# EAGLE design controller (EAGLE 7.3.0)
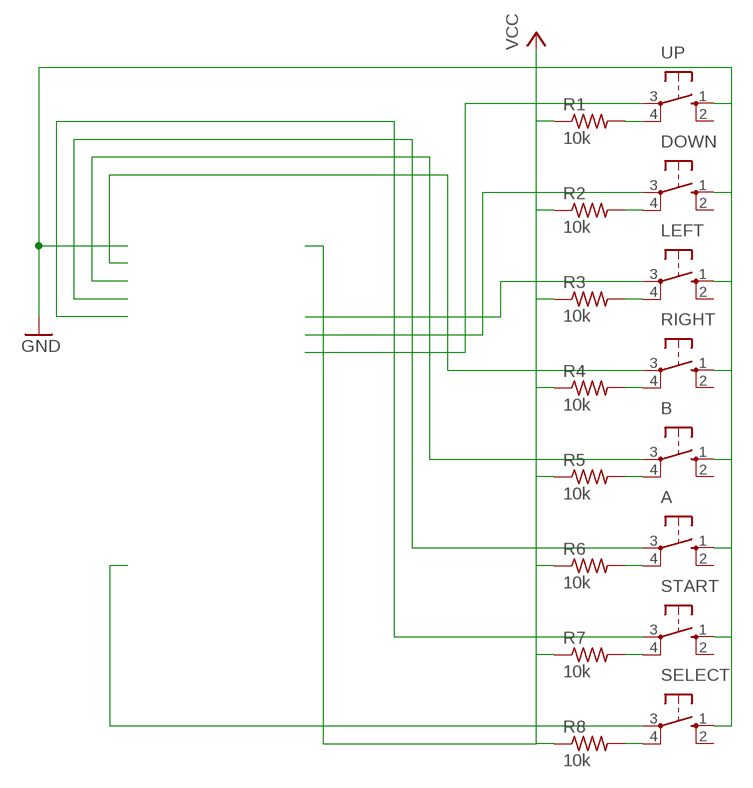
[diagram p0: schematic, sheet 1]

## Parts
A  10-XX  [B3F-10XX]
B  10-XX  [B3F-10XX]
DOWN  10-XX  [B3F-10XX]
LEFT  10-XX  [B3F-10XX]
R1  10k  R-US_0204/7  [0204/7]
R2  10k  R-US_0204/7  [0204/7]
R3  10k  R-US_0204/7  [0204/7]
R4  10k  R-US_0204/7  [0204/7]
R5  10k  R-US_0204/7  [0204/7]
R6  10k  R-US_0204/7  [0204/7]
R7  10k  R-US_0204/7  [0204/7]
R8  10k  R-US_0204/7  [0204/7]
RIGHT  10-XX  [B3F-10XX]
SELECT  10-XX  [B3F-10XX]
START  10-XX  [B3F-10XX]
UP  10-XX  [B3F-10XX]

## Nets
GND: A.1(S) B.1(S) DOWN.1(S) LEFT.1(S) RIGHT.1(S) SELECT.1(S) START.1(S) UP.1(S)
N$1: UP.3(P)
N$2: DOWN.3(P)
N$3: LEFT.3(P)
N$4: RIGHT.3(P)
N$5: B.3(P)
N$6: A.3(P)
N$7: START.3(P)
N$8: SELECT.3(P)
N$9: DOWN.4(P1) R2.2
N$10: LEFT.4(P1) R3.2
N$12: R1.1 R2.1 R3.1 R4.1 R5.1 R6.1 R7.1 R8.1 ; supply symbol labelled VCC
N$15: R7.2 START.4(P1)
N$16: R4.2 RIGHT.4(P1)
N$17: A.4(P1) R6.2
N$18: B.4(P1) R5.2
N$21: R8.2 SELECT.4(P1)
N$35: R1.2 UP.4(P1)
Unconnected: A.2(S1) B.2(S1) DOWN.2(S1) LEFT.2(S1) RIGHT.2(S1) SELECT.2(S1) START.2(S1) UP.2(S1)

## Library data of the parts
A B DOWN LEFT RIGHT SELECT START UP = switch-omron:10-XX: OMRON SWITCH; MPN: B3F-1000; OC_FARNELL: 176432; OC_NEWARK: 36M3542
R1-R8 = adafruit:R-US_: RESISTOR, American symbol

## Board
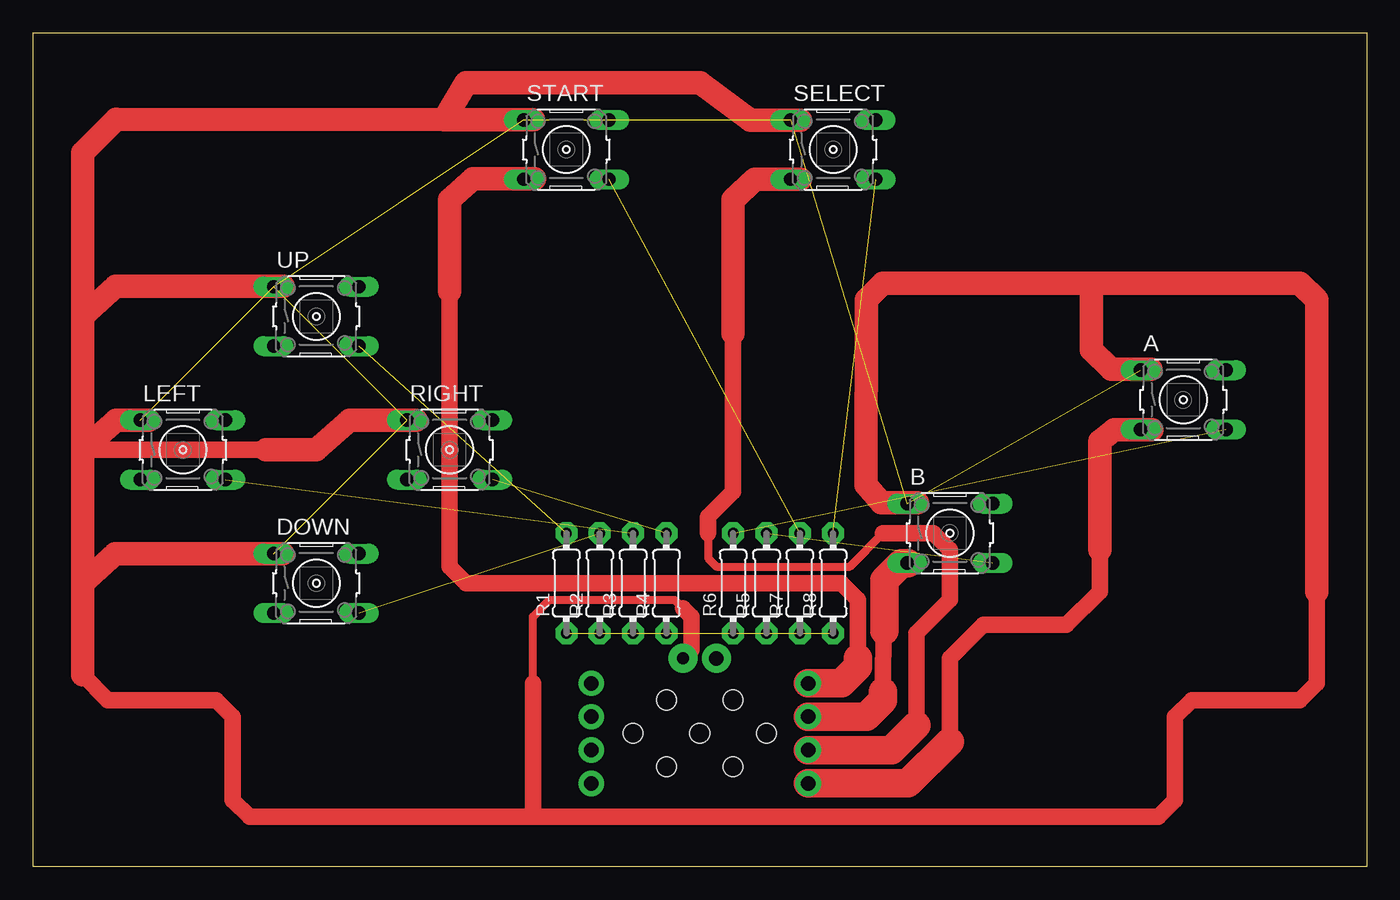
[diagram p1: board, top side]
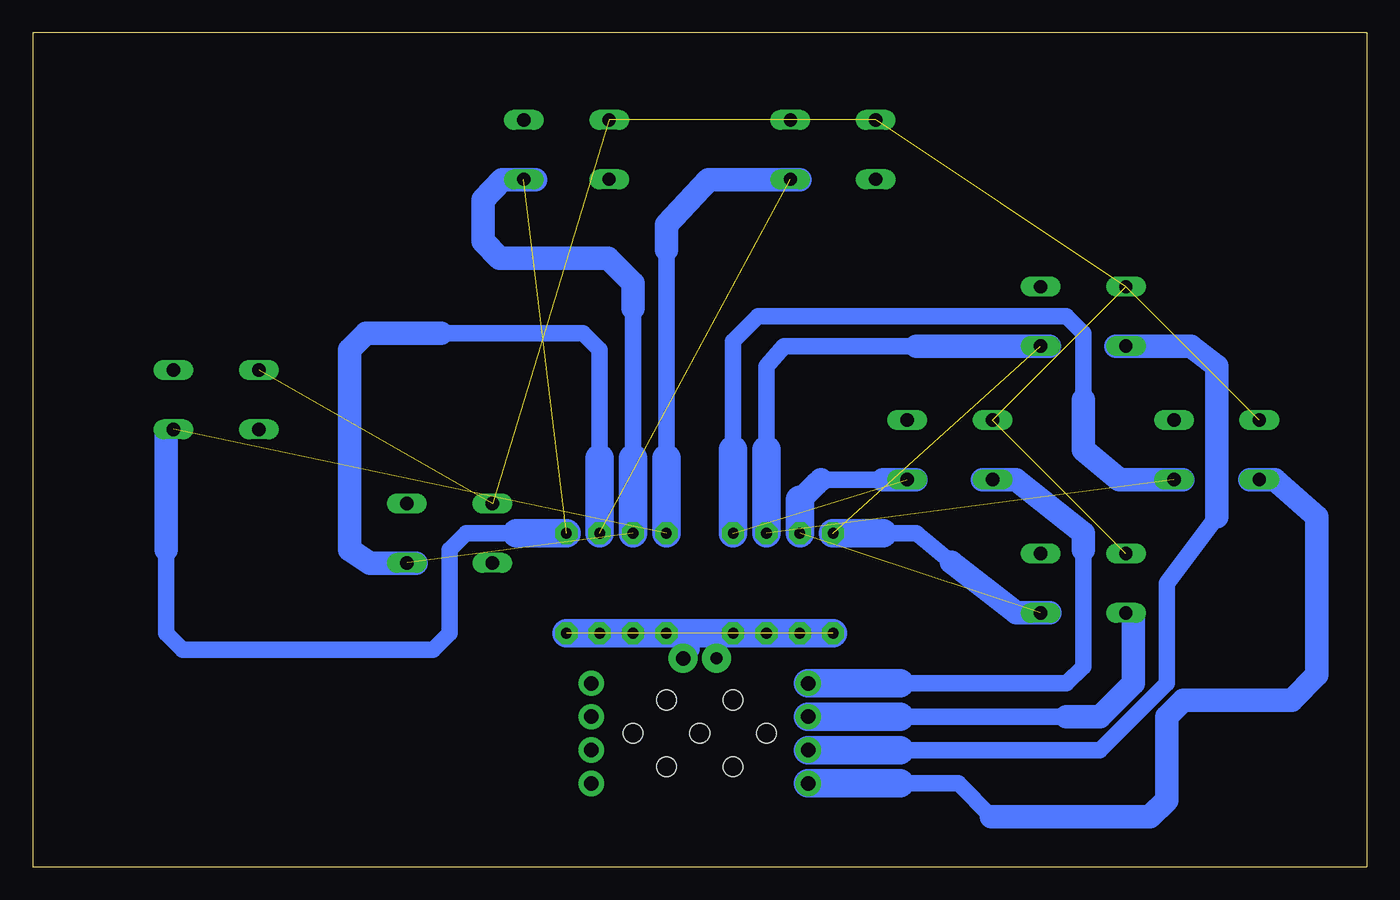
[diagram p2: board, bottom side, seen from below]

Size 101.6 x 63.5 mm. Coordinates in mm from the lower left corner, seen from the top.
Outline: 0,63.5 101.6,63.5 101.6,0 0,0 0,63.5
Copper layers (1*16): Top 0.035mm / dielectric 1.5mm / Bottom 0.035mm
Design rules "default": minimum track width 10mil, minimum drill 24mil, track to track 8mil, track to pad 8mil, pad to pad 8mil, via to via 8mil, smd to smd 8mil, copper to edge 40mil, drill to drill 8mil, minimum pad ring 10mil, minimum via ring 8mil, stop-mask expansion 4mil, vias tented up to drill 0mil, thermal gap 10mil
Holes 1.5 mm at 45.72,10.16 48.26,7.62 48.26,12.7 50.8,10.16 53.34,7.62 53.34,12.7 55.88,10.16

### Footprints (pad centres in the part's own frame; a part is rotated, then mirrored left to right if it is on the bottom)
B3F-10XX = drill 1.016 long: 1 -3.251,2.261; 2 3.251,2.261; 3 -3.251,-2.261; 4 3.251,-2.261
0204/7 = drill 0.813 pad 1.676 octagon: 1 -3.81,0; 2 3.81,0

### Placement (x,y rotation side)
A  87.63,35.56 0 top
B  69.85,25.4 0 top
DOWN  21.59,21.59 0 top
LEFT  11.43,31.75 0 top
R1  40.64,21.59 90 top
R2  43.18,21.59 90 top
R3  45.72,21.59 90 top
R4  48.26,21.59 90 top
R5  55.88,21.59 90 top
R6  53.34,21.59 90 top
R7  58.42,21.59 90 top
R8  60.96,21.59 90 top
RIGHT  31.75,31.75 0 top
SELECT  60.96,54.61 0 top
START  40.64,54.61 0 top
UP  21.59,41.91 0 top

### Tracks (layer width: path | path; a pad name or v marks a point on that pad's centre or on a via)
GND  (7 unrouted)
N$9  (1 unrouted)
  Bottom 1.27: 36.85,29.49 41.58,29.49
  Bottom 1.778: R2.2 43.18,27.91 41.91,29.18 41.58,29.49 | 36.85,29.49 34.31,29.49
  Bottom 2.184: R2.2 43.18,27.94
N$10  (1 unrouted)
  Bottom 0.61: 34.92,39.62 34.29,39.62
  Bottom 1.27: 34.92,39.62 44.37,39.62 45.72,38.1 45.72,31.75
  Bottom 1.778: 24.16,39.62 34.29,39.62
  Bottom 2.184: R3.2 45.72,31.75
N$11  (via drill 1.1 pad 1.93)
  Top 0.61: 64.77,13.97 64.77,13.34
  Top 1.27: 67.28,23.11 66.65,23.11 66.09,23.11 64.82,21.84 64.77,13.97
  Top 2.184: v59.05,11.43 63.5,11.43 64.77,12.7 64.77,13.34 | 66.65,23.11 66.17,23.11 64.87,21.82 64.87,17.98
N$12  (via drill 1.1 pad 1)  (7 unrouted)
  Bottom 0.61: 51.44,17.14 51.44,17.78 | R1.1 R4.1 51.44,17.78 | 51.44,17.78 R6.1 R8.1
  Bottom 1.27: 51.44,17.14 51.44,16.51 v52.07,15.88
  Bottom 2.184: R1.1 R8.1
N$13  (via drill 1.1 pad 1.93)
  Top 0.61: 62.87,16.51 62.87,15.88
  Top 1.27: 31.75,43.81 31.75,22.86 33.02,21.59 61.59,21.59 62.87,20.32 62.87,16.51
  Top 1.778: 38.23,52.38 33.53,52.38 31.75,50.8 31.75,43.81
  Top 2.184: v59.05,13.97 61.59,13.97 62.87,15.24 62.87,15.88
N$14  (via drill 1.1 pad 1.93)
  Top 0.61: 64.77,6.35 66.67,6.35 | 69.85,9.53 69.85,10.16 | 81.28,23.5 81.28,24.13 81.28,26.67
  Top 1.27: v59.05,6.35 64.77,6.35 | 81.28,23.5 81.28,20.95 78.74,18.41 72.39,18.41 69.85,15.88 69.85,10.16
  Top 1.778: 85.22,33.27 82.37,33.27 81.28,32.38 81.28,24.13
  Top 2.184: v59.05,6.35 66.67,6.35 69.85,9.53
N$15  (1 unrouted)
  Bottom 0.61: 58.42,31.11 58.42,31.75 | 69.85,40.64 70.48,40.64
  Bottom 1.27: 69.85,40.64 59.69,40.64 58.42,39.37 58.42,31.75
  Bottom 1.778: 72.42,23.11 75.92,23.11 77.47,24.13 77.47,39.37 76.2,40.64 70.48,40.64
  Bottom 2.184: R7.2 58.42,31.11
N$16  (1 unrouted)
  Bottom 0.61: 48.26,31.75 48.26,32.38 | 21.59,36.2 21.59,35.56
  Bottom 1.27: 48.26,32.38 48.26,40.01 46.35,41.91 22.86,41.91 21.59,40.64 21.59,36.2
  Bottom 1.778: 14.02,29.46 18.85,29.46 21.59,31.75 21.59,35.56
  Bottom 2.184: R4.2 48.26,31.75
N$17  (1 unrouted)
  Bottom 0.61: 53.34,31.11 53.34,31.75
  Bottom 1.27: 53.34,31.75 53.34,46.99
  Bottom 1.778: 43.18,52.32 50.14,52.32 53.34,48.9 53.34,46.99
  Bottom 2.184: R6.2 53.34,31.11
N$18  (1 unrouted)
  Bottom 0.61: 55.88,31.11 55.88,31.75 | 55.88,41.91 55.88,42.55
  Bottom 1.27: 64.59,52.09 63.32,52.32 | 67.31,48.26 66.04,46.35 | 55.88,41.91 55.88,31.75
  Bottom 1.778: 63.32,52.32 65.86,52.3 67.31,50.8 67.31,48.26 67.31,47.62 66.04,46.35 57.78,46.35 55.88,44.45 55.88,42.55
  Bottom 2.184: R5.2 55.88,31.11
N$19  (via drill 1.1 pad 1.93)
  Bottom 0.61: 21.59,24.13 21.59,23.5 | 34.92,13.97 35.56,13.97
  Bottom 1.27: 21.59,23.5 21.59,15.24 22.86,13.97 34.92,13.97
  Bottom 1.778: 29.26,29.49 26.72,29.49 21.59,25.4 21.59,24.13
  Bottom 2.184: v42.55,13.97 39.37,13.97 35.56,13.97
N$20
  Top 0.61: 97.79,20.95 97.79,20.32 | 38.1,13.97 38.1,19.05 39.37,20.32 48.9,20.32 49.53,19.68 | 17.78,31.75 17.14,31.75 | 4.45,31.75 3.81,31.75
  Top 1.27: 64.77,44.45 80.64,44.45 | 80.64,44.45 96.52,44.45 | 37.01,56.95 31.32,56.9 | 80.64,43.81 80.64,44.45 | 49.53,15.88 50.16,16.51 50.16,19.05 49.53,19.68 | 97.79,20.32 97.79,13.97 96.52,12.7 88.27,12.7 87,11.43 87,5.08 85.72,3.81 38.1,3.81 | 38.1,3.81 16.51,3.81 15.24,5.08 15.24,11.43 13.97,12.7 5.71,12.7 3.81,14.61 | 17.14,31.75 4.45,31.75 | 38.1,3.81 38.1,13.97
  Top 1.778: 58.47,56.84 54.66,56.84 50.8,59.69 33.02,59.69 31.32,56.9 | 31.32,56.9 6.35,56.92 3.81,54.38 3.81,41.91 | 3.81,41.91 3.81,31.75 | 3.81,31.75 3.81,21.59 | 3.81,21.59 3.81,14.61 | 19.02,23.85 6.27,23.85 3.81,21.59 | 8.81,34.01 6.35,34.01 3.81,31.75 | 29.21,34.01 24.13,34.01 21.59,31.75 17.78,31.75 | 19.05,44.2 6.3,44.2 3.81,41.91 | 38.15,56.9 31.32,56.9 | 67.39,27.71 64.64,27.71 63.48,29.08 63.5,43.18 64.77,44.45 96.52,44.45 97.79,43.18 97.79,20.95 | 85.14,37.87 82.17,37.87 80.64,39.37 80.64,43.81
N$21  (1 unrouted)
  Bottom 0.61: 64.77,25.4 65.41,25.4
  Bottom 1.27: 65.41,25.4 68.58,25.4 69.85,24.13 69.85,17.78 71.12,16.51 90.17,16.51 91.44,17.78 91.44,24.13
  Bottom 1.778: 91.44,33.02 91.44,24.13
  Bottom 2.184: R8.2 64.77,25.4
N$22  (via drill 0.9 pad 2.18)
  other vias: 52.07,15.88
N$23  (via drill 1.1 pad 1.93)
  Bottom 0.61: 22.86,11.43 34.92,11.43 35.56,11.43
  Bottom 1.27: 34.92,11.43 22.23,11.43
  Bottom 1.778: 22.86,11.43 22.23,11.43 20.32,11.43 17.78,13.97 17.78,19.05
  Bottom 2.184: v42.55,11.43 35.56,11.43
N$24  (via drill 1.1 pad 1.93)
  Bottom 0.61: 34.92,8.89 35.56,8.89
  Bottom 1.27: 34.92,8.89 20.32,8.89 15.24,13.97 15.24,21.59 11.43,26.67
  Bottom 1.778: 19.1,39.65 13.39,39.65 11.43,38.1 11.43,26.67
  Bottom 2.184: v42.55,8.89 35.56,8.89
N$25  (via drill 0.9 pad 2.18)
  other vias: 49.53,15.88
N$29  (via drill 1.1 pad 1.93)
  Bottom 1.27: 28.57,3.81 31.11,6.35 35.56,6.35
  Bottom 1.778: 8.91,29.46 7.01,29.46 3.81,26.67 3.81,14.61 5.71,12.7 13.97,12.7 15.24,11.43 15.24,5.08 16.51,3.81 28.57,3.81
  Bottom 2.184: v42.55,6.35 35.56,6.35
N$30  (via drill 1.1 pad 1.93)
  Top 0.61: 53.34,40.64 53.34,40.01 | 51.44,25.4 51.44,23.5 52.07,22.86 62.23,22.86 64.77,25.4 | 67.31,11.43 67.31,10.79 | 64.77,8.89 63.5,8.89
  Top 1.27: v59.05,8.89 63.5,8.89 | 67.31,11.43 67.31,17.78 69.85,20.32 69.85,24.13 68.58,25.4 64.77,25.4 | 53.34,40.01 53.34,28.57 51.44,26.67 51.44,25.4
  Top 1.778: 58.47,52.35 55.02,52.35 53.34,50.8 53.34,40.64 | v59.05,8.89 64.77,8.89 65.41,8.89
  Top 2.184: v59.05,8.89 65.41,8.89 67.31,10.79
N$35  (1 unrouted)
  Bottom 0.61: 36.83,25.4 36.2,25.4
  Bottom 1.27: 36.2,25.4 34.29,25.4 31.62,23.19
  Bottom 1.778: 31.62,23.19 26.67,19.33 24.13,19.33
  Bottom 2.184: R1.2 36.83,25.4

### Text on the board
Name: VCC | GND